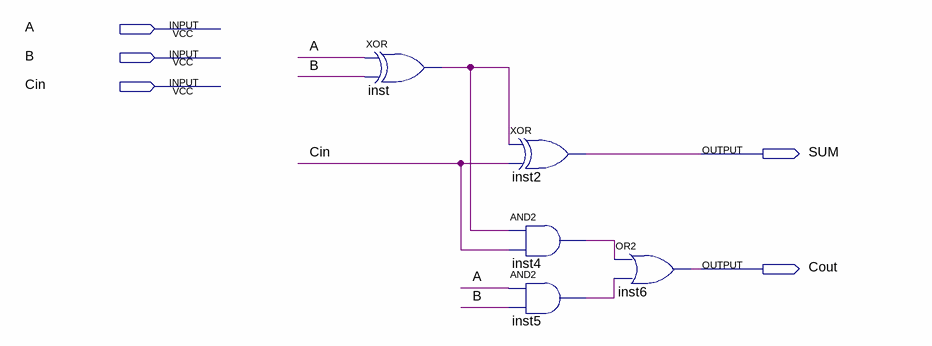
[diagram p0: schematic sheet]
// Quartus schematic 1bit_ADD.bdf as structural Verilog: 5 symbols, 5 pins
module \1bit_ADD  (
  input  A,
  input  B,
  input  Cin,
  output SUM,
  output Cout
);

  wire inst4_out, inst5_out, inst_out;

  xor inst (inst_out, A, B);
  xor inst2 (SUM, inst_out, Cin);
  and inst4 (inst4_out, inst_out, Cin);
  and inst5 (inst5_out, A, B);
  or inst6 (Cout, inst4_out, inst5_out);
endmodule
